# Altium project PCB_Project.PrjPcb
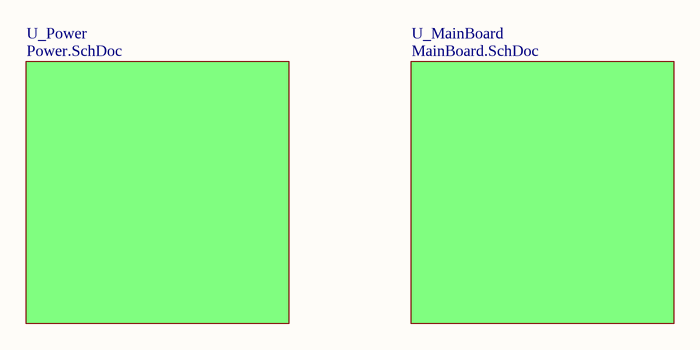
[diagram p0: System.SchDoc]
3 sheets, 49 parts. Net scope: global (net labels, ports and power ports of the same name join across sheets).
Board file: MainBoard.PcbDoc
Sheets:
  System.SchDoc
    U_MainBoard = MainBoard.SchDoc
    U_Power = Power.SchDoc

## Sheet System.SchDoc
size A4

### Sub-sheets
U_MainBoard = MainBoard.SchDoc: no entries
U_Power = Power.SchDoc: no entries

### Notes on the sheet
- Title
- Size:
- Date:
- A4
- Number:
- Time:
- Revision:
- Sheet
- of
- File:

## Sheet MainBoard.SchDoc
size A4
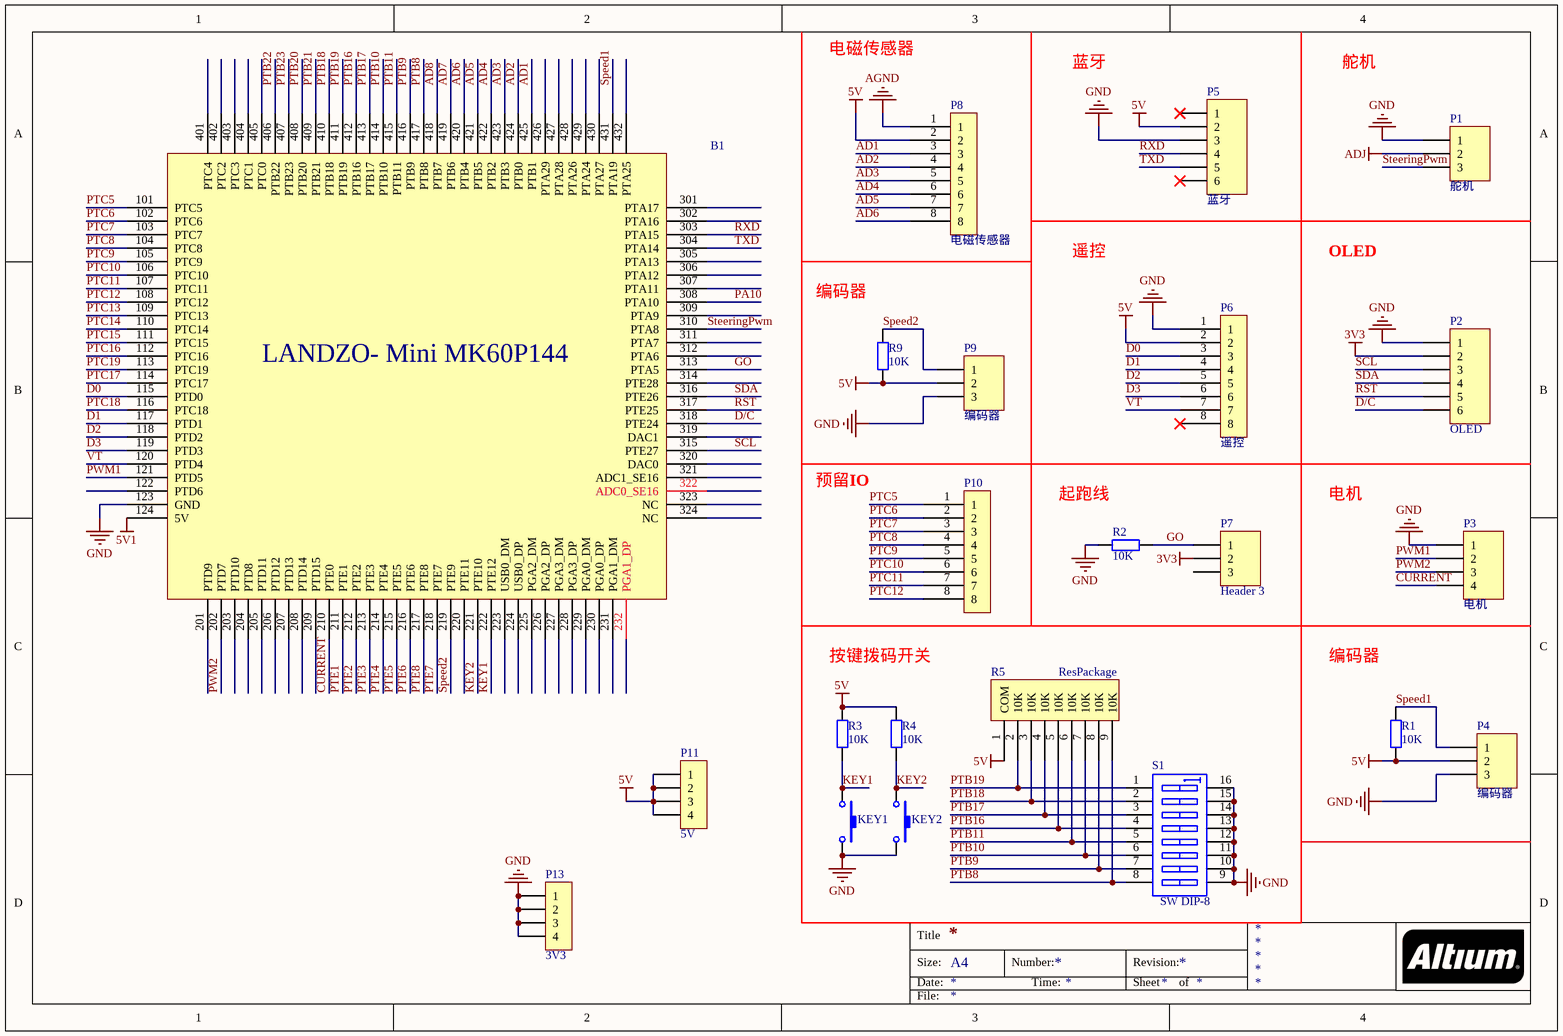
[diagram p1: MainBoard.SchDoc]

### Parts
B1  K60P144_system  [锋速MK60P144_system]  (value not drawn)
KEY1  SW-4  [SW-4]  (value not drawn)
KEY2  SW-4  [SW-4]  (value not drawn)
P1  舵机  [XH1X3]
P2  OLED  [XH2.54_6P2]
P3  电机  [XH1X4]
P4  编码器  [XH1X3]
P5  蓝牙  [XH2.54_6P2]
P6  遥控  [XH2.54_8P2]
P7  Header 3  [XH1X3]
P8  电磁传感器  [XH2.54_8P]
P9  编码器  [XH1X3]
P10  (no value)  [XH2.54_8P2]
P11  5V  [XH2.54_4P2]
P13  3V3  [XH2.54_4P2]
R1  value 10K  [ty0805ss]  (hidden comment: Res2)
R2  value 10K  [ty0805ss]  (hidden comment: Res2)
R3  value 10K  [ty0805ss]  (hidden comment: Res2)
R4  value 10K  [ty0805ss]  (hidden comment: Res2)
R5  ResPackage  [HDR1X9]
R9  value 10K  [ty0805ss]  (hidden comment: Res2)
S1  SW DIP-8  [DIP-16]

### Nets
3V3: P2.2 P7.2
5V: P4.2 P5.2 P6.2 P8.2 P9.2 P11.1 P11.2 P11.3 P11.4 R1.1 R3.2 R4.2 R5.1(COM) R9.1
5V1: B1.124(5V)
ADJ: P1.2
AGND: P8.1
GND: B1.123(GND) KEY1.2 KEY2.2 P1.1 P2.1 P3.1 P4.3 P5.3 P6.1 P9.3 P13.1 P13.2 P13.3 P13.4 R2.2 S1.9(B8) S1.10(B7) S1.11(B6) S1.12(B5) S1.13(B4) S1.14(B3) S1.15(B2) S1.16(B1)
AD1: B1.425(PTB1) P8.3
AD2: B1.424(PTB0) P8.4
AD3: B1.423(PTB3) P8.5
AD4: B1.422(PTB2) P8.6
AD5: B1.421(PTB5) P8.7
AD6: B1.420(PTB4) P8.8
AD7: B1.419(PTB6)
AD8: B1.418(PTB7)
CURRENT: B1.210(PTE0) P3.4
D0: B1.115(PTD0) P6.3
D1: B1.117(PTD1) P6.4
D2: B1.118(PTD2) P6.5
D3: B1.119(PTD3) P6.6
D/C: B1.318(PTE24) P2.6
GO: B1.313(PTA5) P7.1 R2.1
KEY1: B1.222(PTE12) KEY1.1 R3.1
KEY2: B1.221(PTE10) KEY2.1 R4.1
PA10: B1.308(PTA10)
PTB8: B1.417(PTB8) R5.9(10K) S1.8(A8)
PTB9: B1.416(PTB9) R5.8(10K) S1.7(A7)
PTB10: B1.414(PTB10) R5.7(10K) S1.6(A6)
PTB11: B1.415(PTB11) R5.6(10K) S1.5(A5)
PTB16: B1.412(PTB16) R5.5(10K) S1.4(A4)
PTB17: B1.413(PTB17) R5.4(10K) S1.3(A3)
PTB18: B1.410(PTB18) R5.3(10K) S1.2(A2)
PTB19: B1.411(PTB19) R5.2(10K) S1.1(A1)
PTB20: B1.408(PTB20)
PTB21: B1.409(PTB21)
PTB22: B1.406(PTB22)
PTB23: B1.407(PTB23)
PTC5: B1.101(PTC5) P10.1
PTC6: B1.102(PTC6) P10.2
PTC7: B1.103(PTC7) P10.3
PTC8: B1.104(PTC8) P10.4
PTC9: B1.105(PTC9) P10.5
PTC10: B1.106(PTC10) P10.6
PTC11: B1.107(PTC11) P10.7
PTC12: B1.108(PTC12) P10.8
PTC13: B1.109(PTC13)
PTC14: B1.110(PTC14)
PTC15: B1.111(PTC15)
PTC16: B1.112(PTC16)
PTC17: B1.114(PTC17)
PTC18: B1.116(PTC18)
PTC19: B1.113(PTC19)
PTE1: B1.211(PTE1)
PTE2: B1.212(PTE2)
PTE3: B1.213(PTE3)
PTE4: B1.214(PTE4)
PTE5: B1.215(PTE5)
PTE6: B1.216(PTE6)
PTE7: B1.218(PTE7)
PTE8: B1.217(PTE8)
PWM1: B1.121(PTD5) P3.2
PWM2: B1.202(PTD7) P3.3
RST: B1.317(PTE25) P2.5
RXD: B1.303(PTA15) P5.4
SCL: B1.315(PTE27) P2.3
SDA: B1.316(PTE26) P2.4
Speed1: B1.431(PTA19) P4.1 R1.2
Speed2: B1.219(PTE9) P9.1 R9.2
SteeringPwm: B1.310(PTA8) P1.3
TXD: B1.304(PTA14) P5.5
VT: B1.120(PTD4) P6.7

Not connected (* = marked no-connect by the designer): B1 122(PTD6) 201(PTD9) 203(PTD10) 204(PTD8) 205(PTD11) 206(PTD12) 207(PTD13) 208(PTD14) 209(PTD15) 220(PTE11) 223(USB0_DM) 224(USB0_DP) 225(PGA2_DM) 226(PGA2_DP) 227(PGA3_DM) 228(PGA3_DP) 229(PGA0_DM) 230(PGA0_DP) 231(PGA1_DM) 232(PGA1_DP) 301(PTA17) 302(PTA16) 305(PTA13) 306(PTA12) 307(PTA11) 309(PTA9) 311(PTA7) 312(PTA6) 314(PTE28) 319(DAC1) 320(DAC0) 321(ADC1_SE16) 322(ADC0_SE16) 323(NC) 324(NC) 401(PTC4) 402(PTC2) 403(PTC3) 404(PTC1) 405(PTC0) 426(PTA29) 427(PTA28) 428(PTA26) 429(PTA24) 430(PTA27) 432(PTA25); P5 1* 6*; P6 8*; P7 3

### Notes on the sheet
- 电磁传感器
- 蓝牙
- 舵机
- 编码器
- 遥控
- OLED
- 预留IO
- (near R2) 起跑线
- 电机
- 按键拨码开关
- Title
- Size:
- Date:
- A4
- Number:
- Time:
- Revision:
- Sheet
- of
- File:
- (in symbol 锋速MINI K60P144_system) LANDZO- Mini MK60P144

### Library data of the parts
B1 = 锋速MINI K60P144_system
KEY1 KEY2 = SW-4: KEY; Published: 24-Mar-1999; Revision: July-2002: Re-released for DXP Platform.; Publisher: Altium Limited
P1 P4 P7 P9 = Header 3: Header, 3-Pin; LatestRevisionDate: 17-Jul-2002; LatestRevisionNote: Re-released for DXP Platform.; Publisher: Altium Limited
P2 P5 = Header 6: Header, 6-Pin; LatestRevisionDate: 17-Jul-2002; LatestRevisionNote: Re-released for DXP Platform.; Publisher: Altium Limited
P3 = Header 4: Header, 4-Pin; LatestRevisionDate: 17-Jul-2002; LatestRevisionNote: Re-released for DXP Platform.; Publisher: Altium Limited
P6 P8 P10 = Header 8X1A: Header, 4-Pin, Dual row; LatestRevisionDate: 17-Jul-2002; LatestRevisionNote: Re-released for DXP Platform.; Publisher: Altium Limited
P11 P13 = Header 4X1A: Header, 4-Pin, Dual row; LatestRevisionDate: 17-Jul-2002; LatestRevisionNote: Re-released for DXP Platform.; Publisher: Altium Limited
R1-R4 R9 = Res2: Resistor贴片封装; Published: 8-Jun-2000; Revision: July-2002: Re-released for DXP Platform.; Publisher: Altium Limited
S1 = SW DIP-8: DIP Switch, 8 Position, SPST; Published: 24-Mar-1999; LatestRevisionDate: 17-Jul-2002; LatestRevisionNote: Re-released for DXP Platform.; PackageReference: DIP_SW_8WAY_SMD; Publisher: Altium Limited; PackageDescription: DIP Switch; 16 Leads

## Sheet Power.SchDoc
size A4
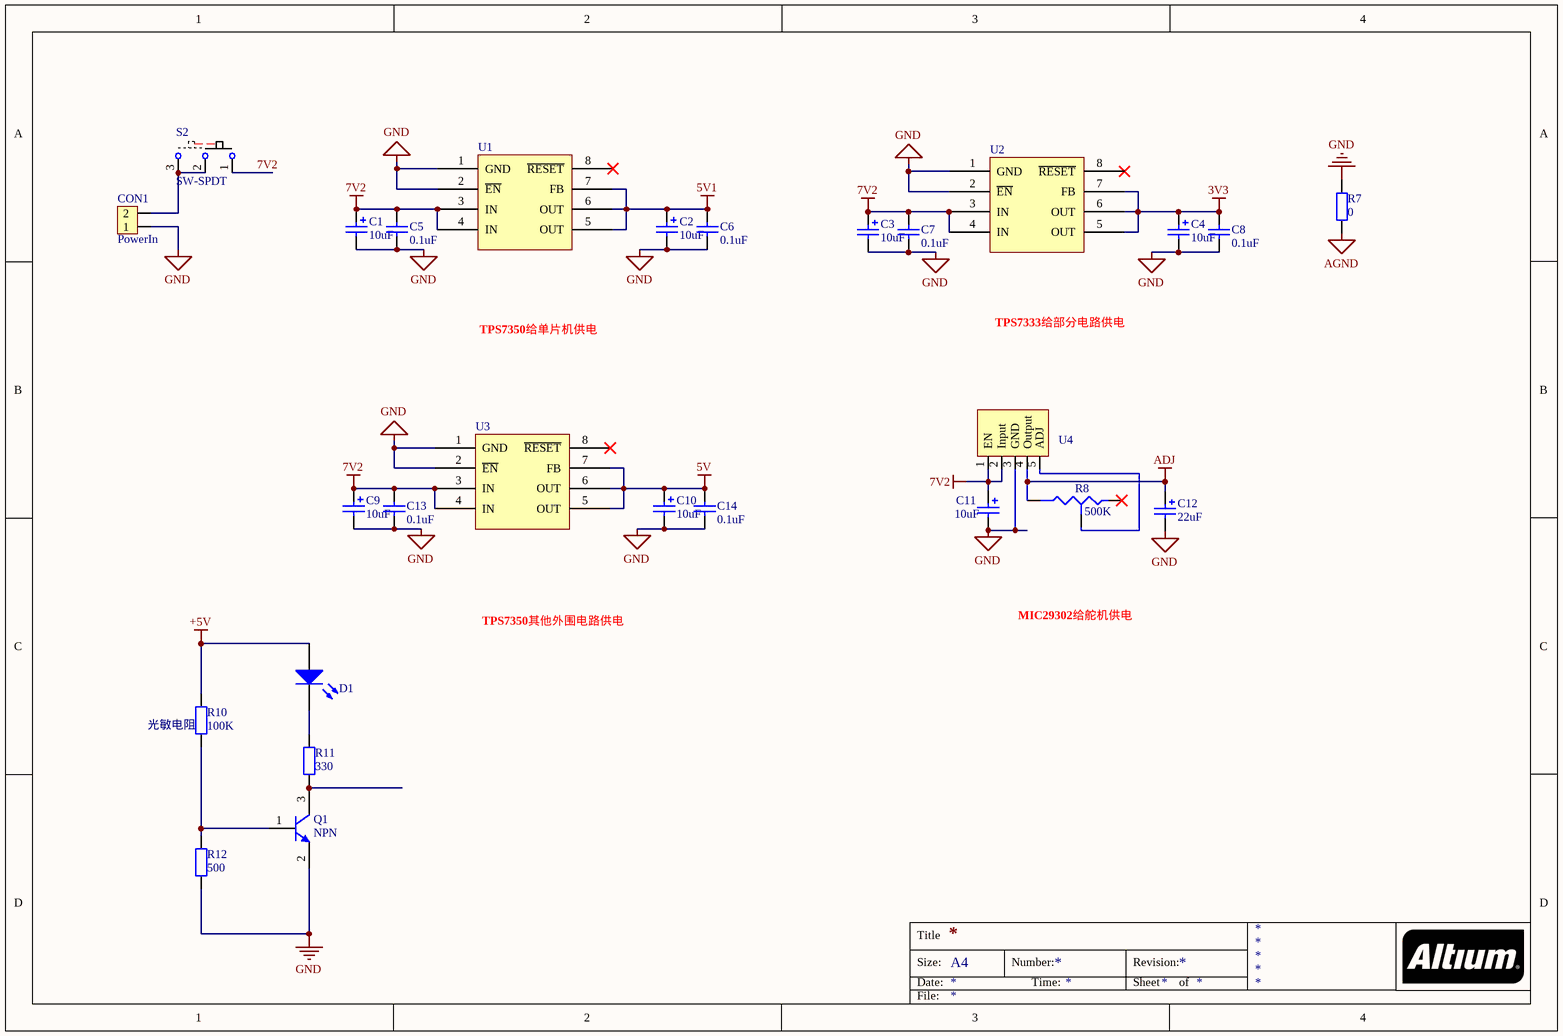
[diagram p2: Power.SchDoc]

### Parts
C1  value 10uF  [Cap-Pol-10UF]  (hidden comment: Cap Pol_22uF)
C2  value 10uF  [Cap-Pol-10UF]  (hidden comment: Cap Pol_22uF)
C3  value 10uF  [Cap-Pol-10UF]  (hidden comment: Cap Pol_22uF)
C4  value 10uF  [Cap-Pol-10UF]  (hidden comment: Cap Pol_22uF)
C5  value 0.1uF  [Cap-0805C]  (hidden comment: Cap Semi)
C6  value 0.1uF  [Cap-0805C]  (hidden comment: Cap Semi)
C7  value 0.1uF  [Cap-0805C]  (hidden comment: Cap Semi)
C8  value 0.1uF  [Cap-0805C]  (hidden comment: Cap Semi)
C9  value 10uF  [Cap-Pol-10UF]  (hidden comment: Cap Pol_22uF)
C10  value 10uF  [Cap-Pol-10UF]  (hidden comment: Cap Pol_22uF)
C11  value 10uF  [Cap-Pol-10UF]  (hidden comment: Cap Pol)
C12  value 22uF  [Cap-Pol-10UF]  (hidden comment: Cap Pol_22uF)
C13  value 0.1uF  [Cap-0805C]  (hidden comment: Cap Semi)
C14  value 0.1uF  [Cap-0805C]  (hidden comment: Cap Semi)
CON1  PowerIn  [KF301-2P]
D1  LED0  [LED-0805]  (value not drawn)
Q1  NPN  [SOT23-3]
R7  value 0  [ty0805ss]  (hidden comment: Res2)
R8  500K  [VR_3362P]
R10  光敏电阻  value 100K  [ty0805ss]
R11  value 330  [ty0805ss]  (hidden comment: Res2)
R12  value 500  [ty0805ss]  (hidden comment: Res2)
S2  SW-SPDT  [SWICH_2]
U1  TPS7350给单片机供电  [SO-8]
U2  TPS7333给部分电路供电  [SO-8]
U3  TPS7350其他外围电路供电  [SO-8]
U4  MIC29302给舵机供电  [TO263-5]

### Nets
3V3: C4.1 C8.1 U2.5(OUT) U2.6(OUT) U2.7(FB)
5V: C10.1 C14.1 U3.5(OUT) U3.6(OUT) U3.7(FB)
5V1: C2.1 C6.1 U1.5(OUT) U1.6(OUT) U1.7(FB)
7V2: C1.1 C3.1 C5.1 C7.1 C9.1 C11.1 C13.1 S2.1 U1.3(IN) U1.4(IN) U2.3(IN) U2.4(IN) U3.3(IN) U3.4(IN) U4.1(EN) U4.2(Input)
+5V: D1.1(A) R10.1
ADJ: C12.1 R8.3 U4.4(Output)
AGND: R7.1
GND: C1.2 C2.2 C3.2 C4.2 C5.2 C6.2 C7.2 C8.2 C9.2 C10.2 C11.2 C12.2 C13.2 C14.2 CON1.1 Q1.2(E) R7.2 R12.2 U1.1(GND) U1.2(~{EN}) U2.1(GND) U2.2(~{EN}) U3.1(GND) U3.2(~{EN}) U4.3(GND)
NetCON1_2: CON1.2 S2.2 S2.3
NetD1_2: D1.2(K) R11.1
NetQ1_1: Q1.1(B) R10.2 R12.1
NetQ1_3: Q1.3(C) R11.2
NetR8_2: R8.2 U4.5(ADJ)

Not connected (* = marked no-connect by the designer): R8 1*; U1 8(~{RESET})*; U2 8(~{RESET})*; U3 8(~{RESET})*

### Notes on the sheet
- Title
- Size:
- Date:
- A4
- Number:
- Time:
- Revision:
- Sheet
- of
- File:

### Library data of the parts
C1-C4 C9 C10 C12 = Cap Pol_22uF: Polarized Capacitor (Surface Mount); Published: 8-Jun-2000; LatestRevisionDate: 29-May-2009; LatestRevisionNote: IPC-7351 Footprint Added.; PackageReference: C0805; Publisher: Altium Limited; PackageDescription: Chip Capacitor
C5-C8 C13 C14 = Cap Semi: Capacitor (Semiconductor SIM Model); Published: 8-Jun-2000; LatestRevisionDate: 29-May-2009; LatestRevisionNote: IPC-7351 Footprint Added.; PackageReference: C1206; Publisher: Altium Limited; PackageDescription: Chip Capacitor
C11 = Cap Pol: Polarized Capacitor (Surface Mount); Published: 8-Jun-2000; LatestRevisionDate: 29-May-2009; LatestRevisionNote: IPC-7351 Footprint Added.; PackageReference: C0805; Publisher: Altium Limited; PackageDescription: Chip Capacitor
CON1 = Header 2: Header, 2-Pin
D1 = LED0: 发光二极管; Published: 8-Jun-2000; LatestRevisionDate: 08-Jul-2005; LatestRevisionNote: Mech Layer 1 removed.; PackageReference: LED-0; Publisher: Altium Limited
Q1 = NPN1: 贴片三极管; Published: 8-Jun-2000; LatestRevisionDate: 15-Jan-2003; LatestRevisionNote: PCB Footprint 'BCY-W3/D4.7' replaced; DatasheetDocument: 1997; PackageDocument: Sep-1998; PackageReference: TO-92A; Publisher: Altium Limited; Code_JEDEC: TO-92A; ComponentLink1Description: Manufacturer Link; ComponentLink1URL: http://www.fairchildsemi.com/; ComponentLink2Description: Datasheet; ComponentLink2URL: http://www.fairchildsemi.com/ds/2N%2F2N3904.pdf
R7 R10-R12 = Res2: Resistor贴片封装; Published: 8-Jun-2000; Revision: July-2002: Re-released for DXP Platform.; Publisher: Altium Limited
R8 = RES-ADJ
S2 = SW-SPDT: SPDT Subminiature Toggle Switch, Right Angle Mounting, Vertical Actuation
U1 U3 = TPS7350
U2 = TPS7333
U4 = MIC29032

## Nets that join several sheets
3V3: MainBoard (P2.2 P7.2), Power (5 pins)
5V: MainBoard (14 pins), Power (5 pins)
5V1: MainBoard (B1.124), Power (5 pins)
ADJ: MainBoard (P1.2), Power (C12.1 R8.3 U4.4)
AGND: MainBoard (P8.1), Power (R7.1)
GND: MainBoard (23 pins), Power (25 pins)